# EAGLE board cs_v2 (EAGLE 9.5.2), part 1 of 2
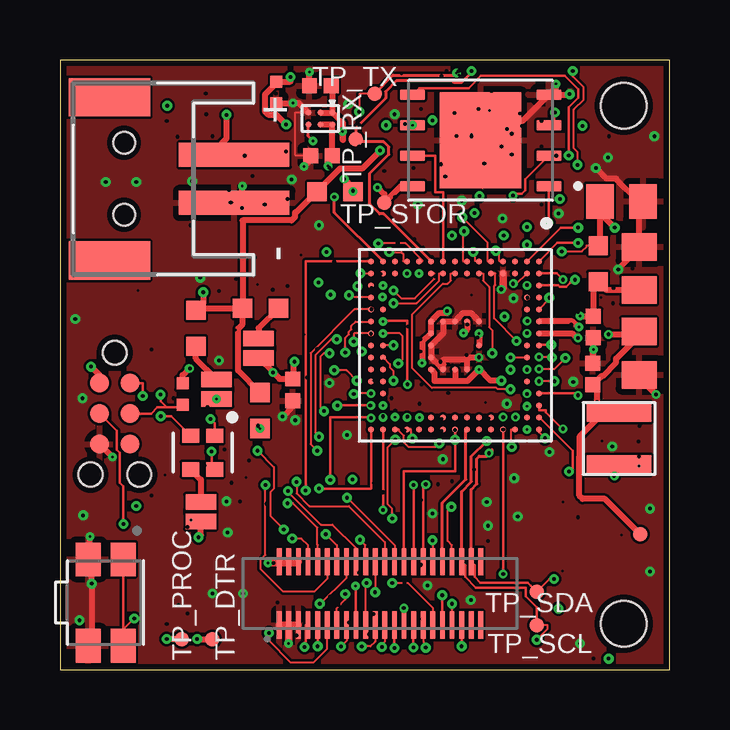
[diagram p4: board, top side]
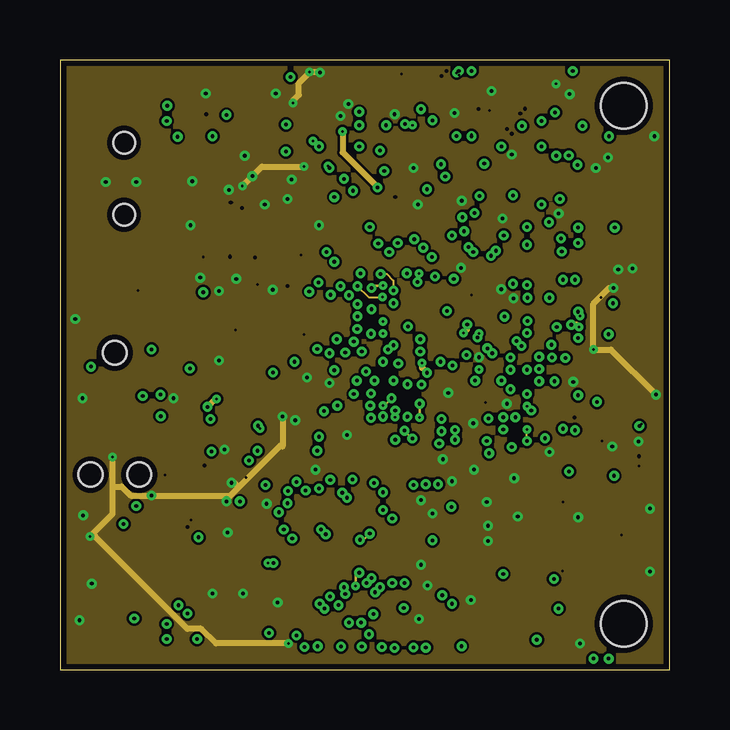
[diagram p5: board, inner layer Route2]
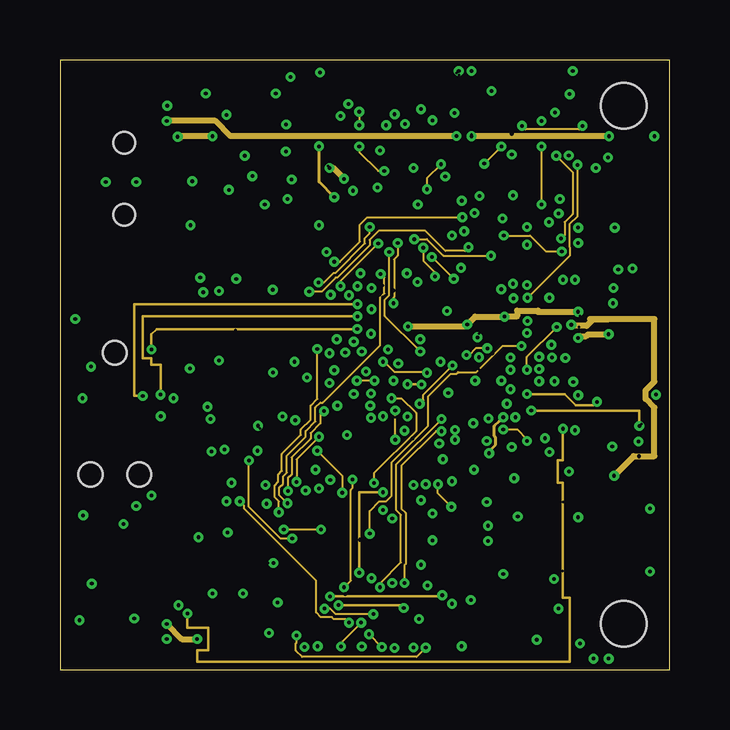
[diagram p6: board, inner layer Route3]
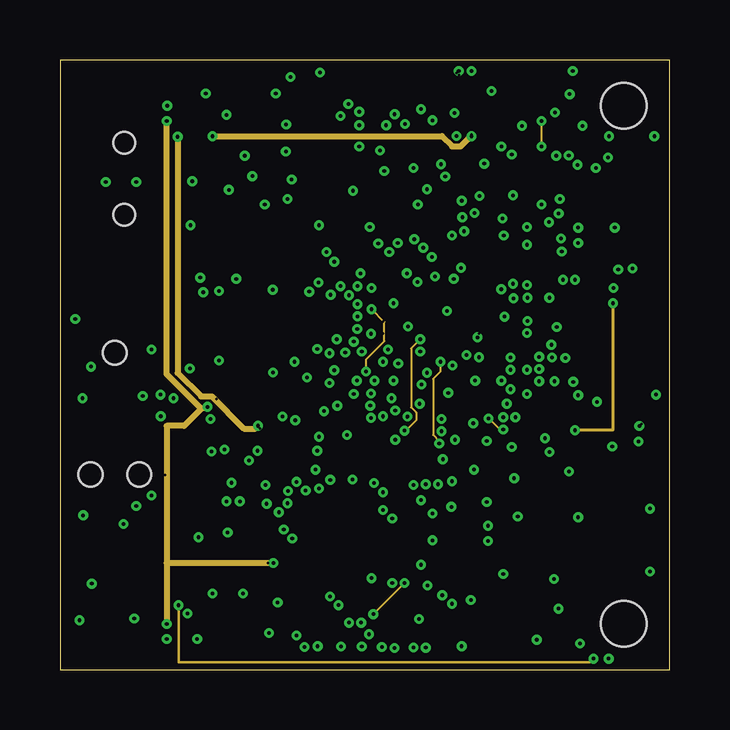
[diagram p7: board, inner layer Route4]
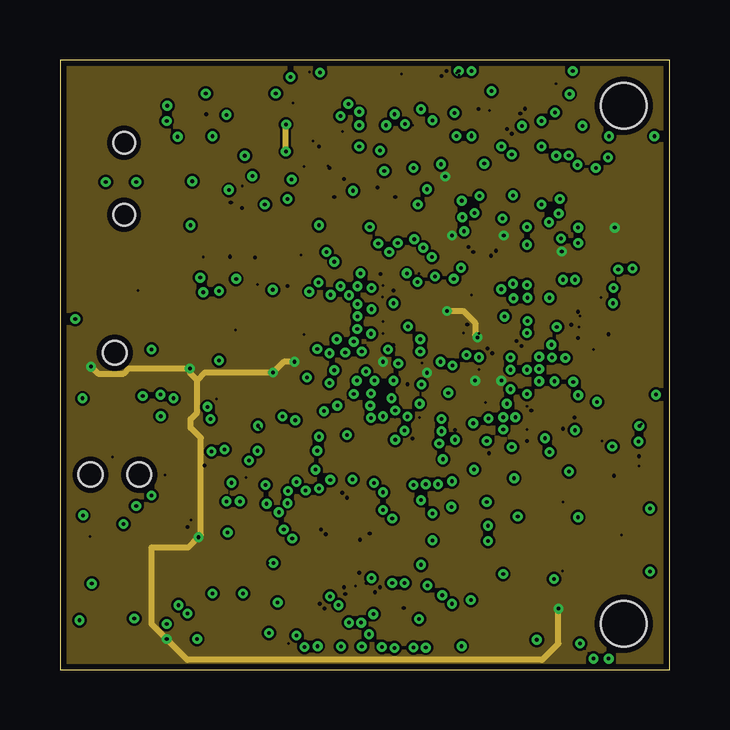
[diagram p8: board, inner layer Route13]
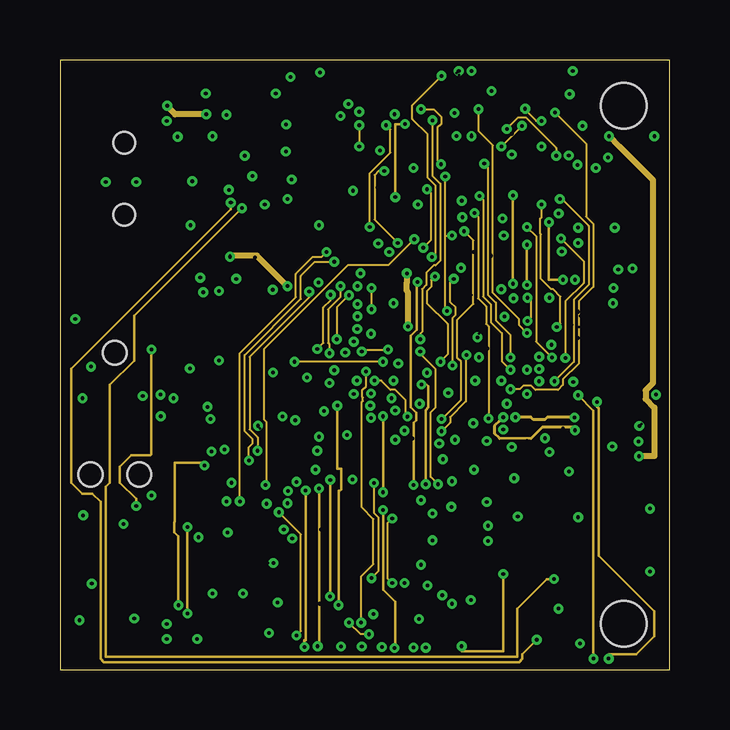
[diagram p9: board, inner layer Route14]
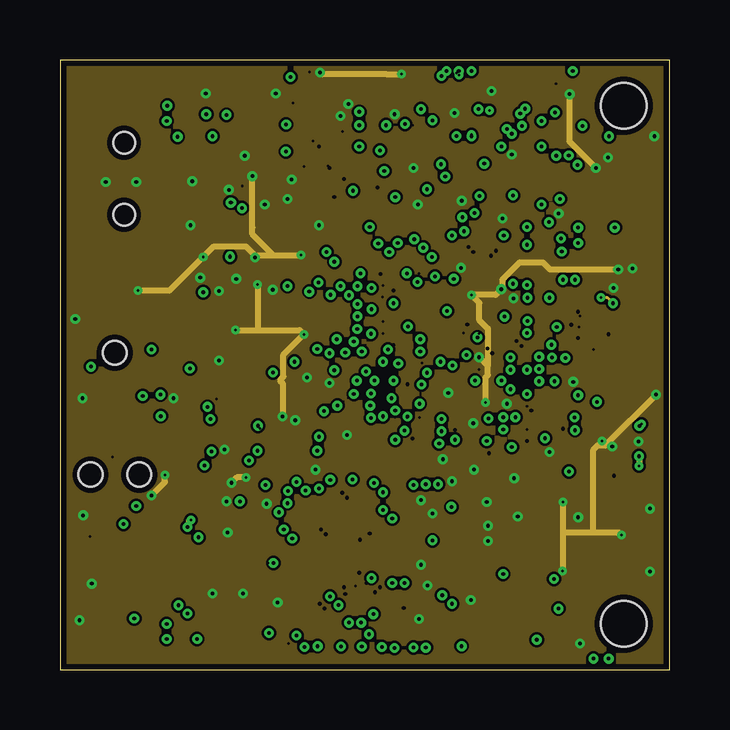
[diagram p10: board, inner layer Route15]
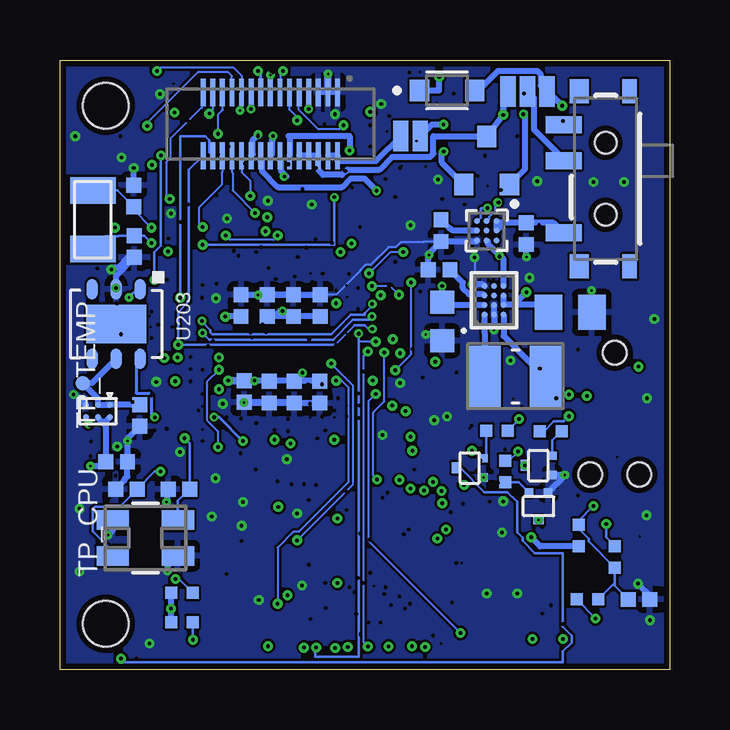
[diagram p11: board, bottom side, seen from below]

Size 25.4 x 25.4 mm. Coordinates in mm from the lower left corner, seen from the top.
Outline: 0,0 25.4,0 25.4,25.4 0,25.4 0,0
Copper layers ([2:1+((2*3)+(4*13)+(14*15))+16:15]): Top 0.035559375mm / dielectric 3.5mil / Route2 0.01778125mm / dielectric 3.5mil / Route3 0.01778125mm / dielectric 4.5mil / Route4 0.01778125mm / dielectric 28mil / Route13 0.01778125mm / dielectric 4.5mil / Route14 0.01778125mm / dielectric 3.5mil / Route15 0.01778125mm / dielectric 3.5mil / Bottom 0.035559375mm
Design rules "CSv2_proto_adv_8layer *": minimum track width 3.5mil, minimum drill 6mil, track to track 4mil, track to pad 4mil, pad to pad 4mil, via to via 4mil, smd to smd 4mil, copper to edge 10mil, drill to drill 5mil, minimum pad ring 5mil, minimum via ring 5mil, stop-mask expansion 4mil, vias tented up to drill 0mil, thermal gap 10mil
Net classes: 1 power_3v3: width 0.254 mm; 5 10_mil: width 0.254 mm
Holes 1.91 mm at 23.5,23.5 23.5,1.91

## Footprints (pad centres in the part's own frame; a part is rotated, then mirrored left to right if it is on the bottom)
C0402 = smd 0.62 x 0.62: 1 -0.45,0; 2 0.45,0
C0805 = smd 1.15 x 1.45: 1 -0.9,0; 2 0.9,0
C0603 = smd 0.95 x 1: 1 -0.8,0; 2 0.8,0
CUS520H3F = smd 0.8 x 0.9: N -1.15,0; P 1.15,0
DIALIGHT_0606_598-8710-307F_0 = smd 0.6 x 0.7: 1 -0.7,0.5; 2 0.7,0.5; 3 -0.7,-0.5; 4 0.7,-0.5
8.06.16_6-PIN_NEEDLE_ADAPTER_NO-LEGS = smd 0.787 x 0.787: 1 -1.27,-0.635; 2 -1.27,0.635; 3 0,-0.635; 4 0,0.635; 5 1.27,-0.635; 6 1.27,0.635 | hole 0.991: -2.54,0; 2.54,1.015; 2.54,-1.015
JST-PH-2-SMT-RA = smd 1 x 4.6: 1 1,-3.7; 2 -1,-3.7 | smd 1.6 x 3.4: NC1 -3.4,1.5; NC2 3.4,1.5
HRS_DF40HC(3.0)-44DS-0.4V(51) = smd 0.2 x 1.14: 1 -4.2,-1.32; 2 -4.2,1.32; 3 -3.8,-1.32; 4 -3.8,1.32; 5 -3.4,-1.32; 6 -3.4,1.32; 7 -3,-1.32; 8 -3,1.32; 9 -2.6,-1.32; 10 -2.6,1.32; 11 -2.2,-1.32; 12 -2.2,1.32; 13 -1.8,-1.32; 14 -1.8,1.32; 15 -1.4,-1.32; 16 -1.4,1.32; 17 -1,-1.32; 18 -1,1.32; 19 -0.6,-1.32; 20 -0.6,1.32; 21 -0.2,-1.32; 22 -0.2,1.32; 23 0.2,-1.32; 24 0.2,1.32; 25 0.6,-1.32; 26 0.6,1.32; 27 1,-1.32; 28 1,1.32; 29 1.4,-1.32; 30 1.4,1.32; 31 1.8,-1.32; 32 1.8,1.32; 33 2.2,-1.32; 34 2.2,1.32; 35 2.6,-1.32; 36 2.6,1.32; 37 3,-1.32; 38 3,1.32; 39 3.4,-1.32; 40 3.4,1.32; 41 3.8,-1.32; 42 3.8,1.32; 43 4.2,-1.32; 44 4.2,1.32
HRS_DF40HC(3.0)-30DS-0.4V(51) = smd 0.2 x 1.14: 1 -2.8,-1.32; 2 -2.8,1.32; 3 -2.4,-1.32; 4 -2.4,1.32; 5 -2,-1.32; 6 -2,1.32; 7 -1.6,-1.32; 8 -1.6,1.32; 9 -1.2,-1.32; 10 -1.2,1.32; 11 -0.8,-1.32; 12 -0.8,1.32; 13 -0.4,-1.32; 14 -0.4,1.32; 15 0,-1.32; 16 0,1.32; 17 0.4,-1.32; 18 0.4,1.32; 19 0.8,-1.32; 20 0.8,1.32; 21 1.2,-1.32; 22 1.2,1.32; 23 1.6,-1.32; 24 1.6,1.32; 25 2,-1.32; 26 2,1.32; 27 2.4,-1.32; 28 2.4,1.32; 29 2.8,-1.32; 30 2.8,1.32
SMT-JUMPER_2_NC_PASTE_NO-SILK = smd 0.635 x 1.27: 1 -0.406,0; 2 0.406,0
SMT-JUMPER_3_1-NC_PASTE_NO-SILK = smd 0.635 x 1.27: 1 -0.813,0; 2 0,0; 3 0.813,0
L1212 = smd 0.813 x 2.667: P$1 -1.1,0; P$2 1.1,0
L0603 = smd 0.8 x 0.8: 1 -0.75,0; 2 0.75,0
L1008 = smd 1.308 x 2.54: 1 -1.257,0; 2 1.257,0
SSSMINI3 = smd 0.35 x 0.35: 1 -0.4,-0.575; 2 0.4,-0.575 | smd 0.45 x 0.35: 3 0,0.575
SOT23-3 = smd 0.797 x 0.9: 1 -0.95,-1; 2 0.95,-1; 3 0,1
R0402 = smd 0.5 x 0.5: 1 -0.45,0; 2 0.45,0
R0603 = smd 0.8 x 0.8: 1 -0.75,0; 2 0.75,0
SW_EVQ-P7L01P = smd 1.4 x 1.05: 1_1 -1.8,0.725; 1_2 1.8,0.725; 2_1 -1.8,-0.725; 2_2 1.8,-0.725
SWITCH_SPST_SMD_A = smd 0.7 x 1.5: 1 -2.25,-1.75; 2 -0.75,-1.75; 3 2.25,-1.75 | smd 1 x 0.6: GND1 -3.65,1; GND3 3.65,1 | smd 1 x 0.8: GND2 -3.65,-1.1; GND4 3.65,-1.1 | hole 0.9: -1.5,0; 1.5,0
TP06R = smd 0.6 x 0.6: TP 0,0
TFBGA120 = smd 0.25 x 0.25: GNDANA0 -1,0; GNDIO0 -3,2; GNDIO1 -1,-0.5; GNDIO2 0,-1; GNDIO3 0.5,-1; GNDIO4 1,-0.5; GNDIO5 1,0.5; GNDIO6 0.5,1; GNDIO7 -1,1; NRESET 0,3.5; PA00 -3.5,3.5; PA01 -3.5,3; PA02 -3.5,1.5; PA03 -3,1; PA04 -3,-1; PA05 -3.5,-1.5; PA06 -3,-1.5; PA07 -3.5,-2; PA08 -3.5,-3.5; PA09 -2.5,-3; PA10 -3,-3.5; PA11 -2,-3; PA12 2,-3.5; PA13 2.5,-3; PA14 2.5,-3.5; PA15 3,-3.5; PA16 3.5,-3.5; PA17 3,-3; PA18 3.5,-3; PA19 3,-2.5; PA20 3,1.5; PA21 3.5,2; PA22 3,2; PA23 3,2.5; PA24 3.5,2.5; PA25 3.5,3; PA27 0,3; PA30 -0.5,3; PA31 -1,3; PB00 -2.5,3.5; PB01 -2.5,3; PB02 -3,3.5; PB03 -3,3; PB04 -3.5,1; PB05 -3.5,0.5; PB06 -3,0; PB07 -3.5,-0.5; PB08 -3,-0.5; PB09 -3.5,-1; PB10 -2.5,-3.5; PB11 -1.5,-3; PB12 -2,-3.5; PB13 -1,-3; PB14 -1.5,-3.5; PB15 -0.5,-3; PB16 3.5,0; PB17 3.5,0.5; PB18 3,0.5; PB19 3.5,1; PB20 3,1; PB21 3.5,1.5; PB22 3.5,3.5; PB23 3,3.5; PB24 3,3; PB25 2.5,3; PB26 2.5,3.5; PB27 2,3; PB28 2,3.5; PB29 1.5,3; PB30 -1.5,3.5; PB31 -1.5,3; PC00 -3.5,2.5; PC01 -3,2.5; PC02 -3.5,2; PC03 -3,1.5; PC04 -3.5,-2.5; PC05 -3,-2.5; PC06 -3.5,-3; PC07 -3,-3; PC10 1,-3; PC11 0.5,-3.5; PC12 1,-3.5; PC13 1.5,-3; PC14 1.5,-3.5; PC15 2,-3; PC16 3.5,-2.5; PC17 3,-2; PC18 3.5,-2; PC19 3,-1.5; PC20 3.5,-1.5; PC21 3,-1; PC22 3.5,-1; PC23 3,-0.5; PC24 1.5,3.5; PC25 1,3; PC26 1,3.5; PC27 0.5,3.5; PC28 0.5,3; PC30 -2,3.5; PC31 -2,3; PD00 -3,0.5; PD01 -3.5,0; PD08 -1,-3.5; PD09 0,-3; PD10 -0.5,-3.5; PD11 0.5,-3; PD12 0,-3.5; PD20 3.5,-0.5; PD21 3,0; VDDANA0 -1,0.5; VDDANA1 -3,-2; VDDCORE -0.5,3.5; VDDIO3 1,-1; VDDIO4 1,0; VDDIO5 1,1; VDDIO6 0,1; VDDIO7 -0.5,1; VDDIOB1 -1,-1; VDDIOB2 -0.5,-1; VSW -1,3.5
8-UDFN = smd 1.04 x 0.44: 1 -2.845,1.905; 2 -2.845,0.635; 3 -2.845,-0.635; 4 -2.845,-1.905; 5 2.845,-1.905; 6 2.845,-0.635; 7 2.845,0.635; 8 2.845,1.905 | smd 3.4 x 4: 9 0,0
BGA9N40P3X3_144X146X69N = smd 0.24 x 0.24: A1 -0.4,0.4; A2 0,0.4; A3 0.4,0.4; B1 -0.4,0; B2 0,0; B3 0.4,0; C1 -0.4,-0.4; C2 0,-0.4; C3 0.4,-0.4
12-WLP = smd 0.244 x 0.244: A1 -0.6,0.4; A2 -0.2,0.4; A3 0.2,0.4; A4 0.6,0.4; B1 -0.6,0; B2 -0.2,0; B3 0.2,0; B4 0.6,0; C1 -0.6,-0.4; C2 -0.2,-0.4; C3 0.2,-0.4; C4 0.6,-0.4
DFN-06 = smd 0.85 x 0.45: 1 -1.45,1; 2 -1.45,0; 3 -1.45,-1; 4 1.45,-1; 5 1.45,0; 6 1.45,1 | smd 1.6 x 2.5: 7 0,0
WLCSP6_2X3 = smd 0.254 x 0.254: A1 -0.25,0.5; A2 0.25,0.5; B1 -0.25,0; B2 0.25,0; C1 -0.25,-0.5; C2 0.25,-0.5
XTAL_EPSON_TSX3225 = smd 1.346 x 0.813: 1 -1.359,-0.75; 2 1.359,-0.75; 3 1.359,0.75; 4 -1.359,0.75
XTAL320X150X90 = smd 1.092 x 1.905: 1 -1.219,0; 2 1.219,0

## Placement (x,y rotation side)
C101  0.1u  [C0402]  1.27,2.92 0 bottom
C102  0.1u  [C0402]  15.67,15.16 90 bottom
C103  0.1u  [C0402]  22.2,12.32 90 top
C104  0.1u  [C0402]  16.76,15.16 90 bottom
C105  0.1u  [C0402]  17.86,15.16 90 bottom
C106  0.1u  [C0402]  14.55,15.16 90 bottom
C107  4.7u  [C0805]  24.13,13.18 270 top
C108  0.1u  [C0402]  22.23,14.27 270 top
C109  0.1u  [C0402]  17.73,11.58 270 bottom
C110  10u  [C0805]  24.13,16.71 90 top
C111  0.1u  [C0402]  16.69,11.56 270 bottom
C112  0.1u  [C0402]  14.58,11.56 270 bottom
C113  0.1u  [C0402]  15.65,11.56 270 bottom
C114  1u  [C0402]  9.7,11.66 270 top
C115  10u  [C0805]  23.39,19.51 0 top
C116  6.8p  [C0402]  20.45,7.52 180 bottom
C117  6.8p  [C0402]  22.63,7.52 180 bottom
C118  10p  [C0402]  22.3,17.63 270 bottom
C119  10p  [C0402]  22.33,19.74 90 bottom
C201  100n  [C0402]  5.97,18.16 270 bottom
C202  10u  [C0603]  9.47,14.5 270 bottom
C203  470n  [C0402]  9.53,18.29 270 bottom
C204  1u  [C0402]  9.6,16.66 180 bottom
C205  22u  [C0805]  4.14,14.88 0 bottom
C206  1u  [C0402]  10.9,21.41 180 top
C207  1u  [C0402]  23.04,8.66 0 bottom
C208  0.1u  [C0402]  10.85,24.33 180 top
C209  0.1u  [C0402]  22.07,10.59 270 bottom
D201  CUS520H3F  [CUS520H3F]  9.27,24.13 180 bottom
D202  DIALIGHT_RGBLED_598-8710-307FDIALIGHT_598-8710-307F_0_0  [DIALIGHT_0606_598-8710-307F_0]  5.94,9.04 270 top
J101  J-JTAG-CORTEX-NEEDLE6  [8.06.16_6-PIN_NEEDLE_ADAPTER_NO-LEGS]  2.29,10.67 270 top
J201  [JST-PH-2-SMT-RA]  3.56,20.45 90 top
J301  HIROSE-DF40_44-PIN_CONNECTORS-RECEPTACLE  [HRS_DF40HC(3.0)-44DS-0.4V(51)]  13.34,3.17 0 top
J302  HIROSE-DF40_30-PIN_CONNECTORS-RECEPTACLE  [HRS_DF40HC(3.0)-30DS-0.4V(51)]  16.64,22.73 180 bottom
JP201  JUMPER-SMT_2_NC_PASTE_NO-SILK  [SMT-JUMPER_2_NC_PASTE_NO-SILK]  10.79,22.23 180 bottom
JP202  JUMPER-SMT_2_NC_PASTE_NO-SILK  [SMT-JUMPER_2_NC_PASTE_NO-SILK]  5.87,6.58 270 top
JP203  JUMPER-SMT_3_1-NC_PASTE_NO-SILK  [SMT-JUMPER_3_1-NC_PASTE_NO-SILK]  5.92,24.08 180 bottom
JP204  JUMPER-SMT_2_NC_PASTE_NO-SILK  [SMT-JUMPER_2_NC_PASTE_NO-SILK]  8.28,13.39 90 top
JP205  JUMPER-SMT_2_NC_PASTE_NO-SILK  [SMT-JUMPER_2_NC_PASTE_NO-SILK]  6.53,11.68 90 top
L101  L1212  [L1212]  23.29,9.63 90 top
L102  L0603  [L0603]  22.43,16.92 90 top
L201  1u  [L1008]  6.43,12.22 0 bottom
Q201  FK3303010L  [SSSMINI3]  5.46,8.51 90 bottom
Q202  DMG3415UFY4Q-7  [SOT23-3]  7.62,21.21 0 bottom
Q203  FK3303010L  [SSSMINI3]  8.33,8.41 90 bottom
Q204  FK3303010L  [SSSMINI3]  5.46,6.81 180 bottom
R101  10k  [R0402]  3.78,5.59 270 bottom
R102  330  [R0402]  3.43,2.92 180 bottom
R103  4.7k  [R0402]  20.32,1.98 180 bottom
R104  4.7k  [R0402]  20.32,3.2 180 bottom
R105  39  [R0402]  2.29,4.7 90 bottom
R106  1k  [R0402]  5.11,11.48 90 top
R201  10M  [R0402]  9.02,24.05 90 top
R202  590  [R0402]  4.95,9.93 0 bottom
R203  590  [R0402]  7.19,9.96 180 bottom
R204  1k  [R0402]  6.86,8.26 270 bottom
R205  10  [R0603]  8.33,10.79 270 top
R206  1  [R0603]  8.36,15.06 0 top
R207  0.51  [R0603]  5.66,14.22 270 top
R208  1  [R0603]  11.46,19.91 0 top
S101  SW_EVQ-P7L01P_SPST_RA  [SW_EVQ-P7L01P]  1.91,2.79 270 top
S201  [SWITCH_SPST_SMD_A]  2.67,20.45 270 bottom
TP_CPU  TPTP06R  [TP06R]  24.18,5.64 0 top
TP_DTR  TPTP06R  [TP06R]  6.35,1.27 180 top
TP_PROC  TPTP06R  [TP06R]  5.08,1.27 90 top
TP_RX  TPTP06R  [TP06R]  12.32,22.1 270 top
TP_SCL  TPTP06R  [TP06R]  19.86,1.85 180 top
TP_SDA  TPTP06R  [TP06R]  19.86,3.25 0 top
TP_STOR  TPTP06R  [TP06R]  13.51,19.46 180 top
TP_TEMP  TPTP06R  [TP06R]  24.46,11.94 180 bottom
TP_TX  TPTP06R  [TP06R]  13.11,24 90 top
U101  ATSAMD51  [TFBGA120]  16.46,13.51 270 top
U102  AT25SF641-MHB-T  [8-UDFN]  17.53,22.05 180 top
U201  COULOMB-MAX17262  [BGA9N40P3X3_144X146X69N]  7.62,18.29 270 bottom
U202  MAX77827BEWC+T  [12-WLP]  7.32,15.39 90 bottom
U203  SENSOR-SI7006  [DFN-06]  23.06,14.4 270 bottom
U204  LOADSWITCH-MIC94164  [WLCSP6_2X3]  10.85,22.96 270 top
U205  LOADSWITCH-MIC94164  [WLCSP6_2X3]  23.83,10.77 270 bottom
Y101  16M  [XTAL_EPSON_TSX3225]  21.84,5.49 180 bottom
Y102  ABS07-32.768KHZ-9-T  [XTAL320X150X90]  24.03,18.75 90 bottom